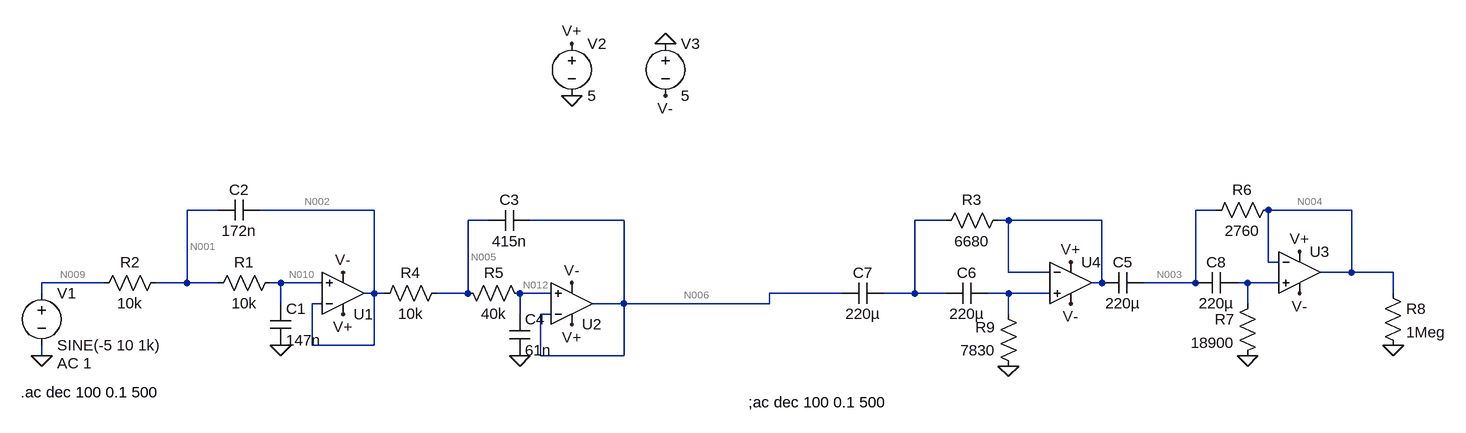
[diagram p0: schematic Draft2.asc]
Draft2.asc, the LTspice schematic file:
Version 4
SHEET 1 1844 680
WIRE -48 64 -96 64
WIRE 192 64 16 64
WIRE 1488 64 1456 64
WIRE 1696 64 1568 64
WIRE 368 80 336 80
WIRE 576 80 432 80
WIRE 1072 80 1024 80
WIRE 1168 80 1152 80
WIRE 1312 80 1168 80
WIRE 1568 144 1568 64
WIRE 1584 144 1568 144
WIRE 1168 160 1168 80
WIRE 1232 160 1168 160
WIRE 1696 160 1696 64
WIRE 1696 160 1648 160
WIRE 1760 160 1696 160
WIRE -224 176 -320 176
WIRE -96 176 -96 64
WIRE -96 176 -144 176
WIRE -48 176 -96 176
WIRE 48 176 32 176
WIRE 112 176 48 176
WIRE 1312 176 1312 80
WIRE 1312 176 1296 176
WIRE 1456 176 1456 64
WIRE 1456 176 1376 176
WIRE 1536 176 1520 176
WIRE 1584 176 1536 176
WIRE -320 192 -320 176
WIRE 192 192 192 64
WIRE 192 192 176 192
WIRE 208 192 192 192
WIRE 336 192 336 80
WIRE 336 192 288 192
WIRE 464 192 416 192
WIRE 912 192 800 192
WIRE 1024 192 1024 80
WIRE 1024 192 976 192
WIRE 1072 192 1024 192
WIRE 1168 192 1136 192
WIRE 1232 192 1168 192
WIRE 1760 192 1760 160
WIRE 48 208 48 176
WIRE 112 208 96 208
WIRE 576 208 576 80
WIRE 576 208 528 208
WIRE 800 208 800 192
WIRE 800 208 576 208
WIRE 1536 208 1536 176
WIRE 416 224 416 192
WIRE 464 224 448 224
WIRE 1168 224 1168 192
WIRE 96 272 96 208
WIRE 192 272 192 192
WIRE 192 272 96 272
WIRE -320 288 -320 272
WIRE 448 288 448 224
WIRE 576 288 576 208
WIRE 576 288 448 288
FLAG -320 288 0
FLAG 496 -112 0
FLAG 640 -192 0
FLAG 496 -192 V+
FLAG 496 240 V+
FLAG 640 -112 V-
FLAG 496 176 V-
FLAG 416 288 0
FLAG 48 272 0
FLAG 144 224 V+
FLAG 144 160 V-
FLAG 1760 272 0
FLAG 1616 128 V+
FLAG 1616 192 V-
FLAG 1536 288 0
FLAG 1168 304 0
FLAG 1264 144 V+
FLAG 1264 208 V-
SYMBOL Opamps\\UniversalOpAmp 496 208 M180
SYMATTR InstName U2
SYMBOL res -128 160 R90
WINDOW 0 0 56 VBottom 2
WINDOW 3 32 56 VTop 2
SYMATTR InstName R2
SYMATTR Value 10k
SYMBOL res 304 176 R90
WINDOW 0 0 56 VBottom 2
WINDOW 3 32 56 VTop 2
SYMATTR InstName R4
SYMATTR Value 10k
SYMBOL res 320 176 M90
WINDOW 0 0 56 VBottom 2
WINDOW 3 32 56 VTop 2
SYMATTR InstName R5
SYMATTR Value 40k
SYMBOL cap 368 64 M90
WINDOW 0 0 32 VBottom 2
WINDOW 3 32 32 VTop 2
SYMATTR InstName C3
SYMATTR Value 415n
SYMBOL voltage -320 176 R0
WINDOW 123 24 124 Left 2
WINDOW 39 0 0 Left 0
SYMATTR Value2 AC 1
SYMATTR InstName V1
SYMATTR Value SINE(-5 10 1k)
SYMBOL voltage 496 -208 R0
WINDOW 123 0 0 Left 0
WINDOW 39 0 0 Left 0
SYMATTR InstName V2
SYMATTR Value 5
SYMBOL voltage 640 -208 R0
WINDOW 123 0 0 Left 0
WINDOW 39 0 0 Left 0
SYMATTR InstName V3
SYMATTR Value 5
SYMBOL cap 32 208 R0
SYMATTR InstName C1
SYMATTR Value 147n
SYMBOL res 48 160 R90
WINDOW 0 0 56 VBottom 2
WINDOW 3 32 56 VTop 2
SYMATTR InstName R1
SYMATTR Value 10k
SYMBOL cap 16 48 R90
WINDOW 0 0 32 VBottom 2
WINDOW 3 32 32 VTop 2
SYMATTR InstName C2
SYMATTR Value 172n
SYMBOL Opamps\\UniversalOpAmp 144 192 M180
SYMATTR InstName U1
SYMBOL cap 400 224 R0
SYMATTR InstName C4
SYMATTR Value 61n
SYMBOL Opamps\\UniversalOpAmp 1616 160 R0
SYMATTR InstName U3
SYMBOL res 1168 64 R90
WINDOW 0 0 56 VBottom 2
WINDOW 3 32 56 VTop 2
SYMATTR InstName R3
SYMATTR Value 6680
SYMBOL res 1584 48 R90
WINDOW 0 0 56 VBottom 2
WINDOW 3 32 56 VTop 2
SYMATTR InstName R6
SYMATTR Value 2760
SYMBOL res 1552 192 M0
SYMATTR InstName R7
SYMATTR Value 18900
SYMBOL cap 1312 160 M90
WINDOW 0 0 32 VBottom 2
WINDOW 3 32 32 VTop 2
SYMATTR InstName C5
SYMATTR Value 220µ
SYMBOL res 1744 176 R0
SYMATTR InstName R8
SYMATTR Value 1Meg
SYMBOL cap 1136 176 R90
WINDOW 0 0 32 VBottom 2
WINDOW 3 32 32 VTop 2
SYMATTR InstName C6
SYMATTR Value 220µ
SYMBOL res 1184 320 R180
WINDOW 0 36 76 Left 2
WINDOW 3 36 40 Left 2
SYMATTR InstName R9
SYMATTR Value 7830
SYMBOL cap 976 176 R90
WINDOW 0 0 32 VBottom 2
WINDOW 3 32 32 VTop 2
SYMATTR InstName C7
SYMATTR Value 220µ
SYMBOL Opamps\\UniversalOpAmp 1264 176 R0
SYMATTR InstName U4
SYMBOL cap 1520 160 R90
WINDOW 0 0 32 VBottom 2
WINDOW 3 32 32 VTop 2
SYMATTR InstName C8
SYMATTR Value 220µ
TEXT -352 344 Left 2 !.ac dec 100 0.1 500
TEXT 768 360 Left 2 !;ac dec 100 0.1 500

The netlist it stands for:
* Draft2.asc
XU2 N012 N006 V+ V- N006 level1 Avol=1Meg GBW=10Meg Vos=0 En=0 Enk=0 In=0 Ink=0 Rin=500Meg  ; pins In+ In- V+ V- OUT
R2 N001 N009 10k
R4 N005 N002 10k
R5 N005 N012 40k
C3 N005 N006 415n
V1 N009 0 SINE(-5 10 1k) AC 1
V2 V+ 0 5
V3 0 V- 5
C1 N010 0 147n
R1 N010 N001 10k
C2 N002 N001 172n
XU1 N010 N002 V+ V- N002 level1 Avol=1Meg GBW=10Meg Vos=0 En=0 Enk=0 In=0 Ink=0 Rin=500Meg  ; pins In+ In- V+ V- OUT
C4 N012 0 61n
XU3 N011 N004 V+ V- N004 level1 Avol=1Meg GBW=10Meg Vos=0 En=0 Enk=0 In=0 Ink=0 Rin=500Meg  ; pins In+ In- V+ V- OUT
R3 N008 N007 6680
R6 N004 N003 2760
R7 N011 0 18900
C5 N008 N003 220µ
R8 N004 0 1Meg
C6 N013 N007 220µ
R9 0 N013 7830
C7 N007 N006 220µ
XU4 N013 N008 V+ V- N008 level1 Avol=1Meg GBW=10Meg Vos=0 En=0 Enk=0 In=0 Ink=0 Rin=500Meg  ; pins In+ In- V+ V- OUT
C8 N011 N003 220µ
.ac dec 100 0.1 500
;ac dec 100 0.1 500
.lib UniversalOpAmp1.lib
.backanno
.end

* Results of the author's LTspice run, read from the files saved beside the schematic
* Operating Point, zero values left out:
*   V(n006) = -4.999 V
*   V(n012) = -4.999 V
*   V(v+) = 5 V
*   V(v-) = -5 V
*   V(n001) = -5 V
*   V(n009) = -5 V
*   V(n005) = -5 V
*   V(n002) = -5 V
*   V(n010) = -5 V
*   I(R1) = 10 nA
*   I(R5) = -9.999 nA
*   I(R4) = 9.999 nA
*   I(R2) = 10 nA
*   I(V3) = -20 nA
*   I(V2) = -60 nA
*   I(V1) = 10 nA
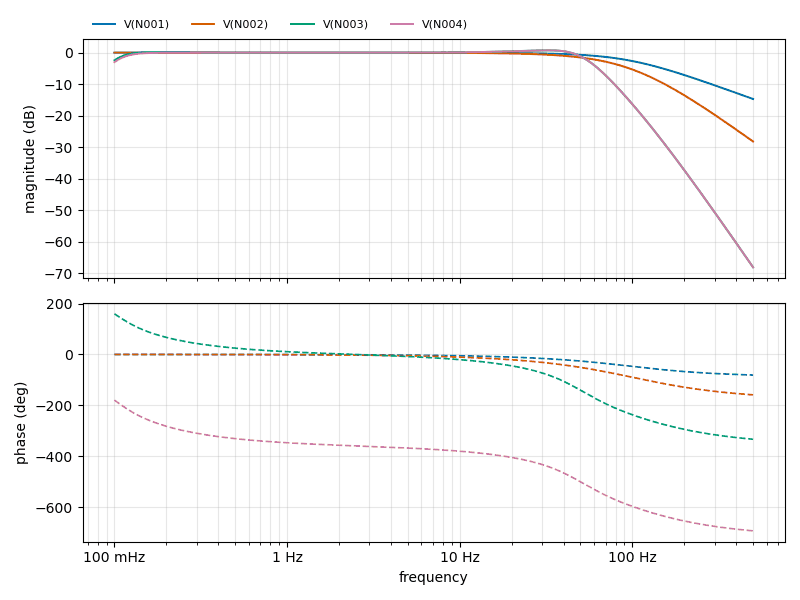
[diagram p1: AC Analysis of Draft2.asc, plotted from the saved traces]
* AC Analysis, 1 run:
*   V(N001): -0.00 dB at 100 mHz, -14.70 dB at 500 Hz, peak -0.00 dB at 100 mHz, 3 dB below the peak at 107.6 Hz
*   V(N002): -0.00 dB at 100 mHz, -28.19 dB at 500 Hz, peak -0.00 dB at 100 mHz, 3 dB below the peak at 71.94 Hz
*   V(N003): -2.42 dB at 100 mHz, -68.14 dB at 500 Hz, peak 0.77 dB at 32.36 Hz, 3 dB below the peak at 101.2 mHz and 54.28 Hz
*   V(N004): -3.01 dB at 100 mHz, -68.14 dB at 500 Hz, peak 0.77 dB at 32.36 Hz, 3 dB below the peak at 105 mHz and 54.28 Hz